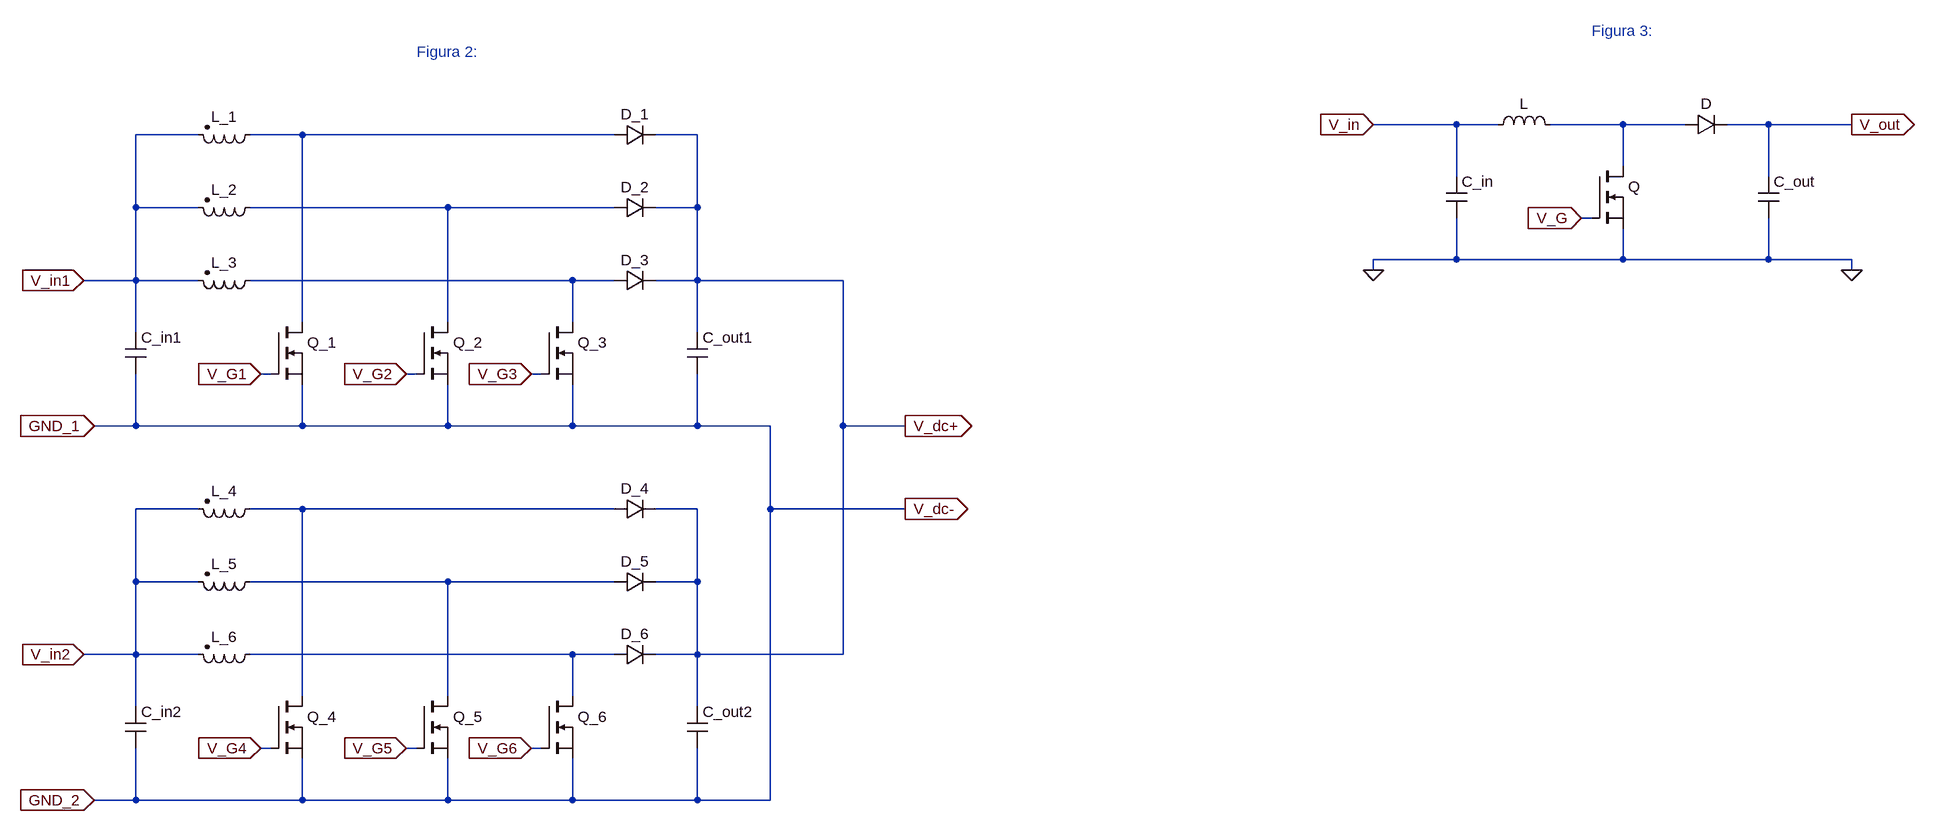
[diagram p0: schematic TFI - Esquemáticos.asc]
TFI - Esquemáticos.asc, the LTspice schematic file:
Version 4
SHEET 1 2784 1176
WIRE 2048 64 1920 64
WIRE 2112 64 2048 64
WIRE 2304 64 2192 64
WIRE 2400 64 2304 64
WIRE 2528 64 2464 64
WIRE 2656 64 2528 64
WIRE 112 80 16 80
WIRE 272 80 192 80
WIRE 752 80 272 80
WIRE 880 80 816 80
WIRE 2304 128 2304 64
WIRE 2048 144 2048 64
WIRE 2528 144 2528 64
WIRE 16 192 16 80
WIRE 112 192 16 192
WIRE 496 192 192 192
WIRE 752 192 496 192
WIRE 880 192 880 80
WIRE 880 192 816 192
WIRE 2256 208 2240 208
WIRE 2048 272 2048 208
WIRE 2048 272 1920 272
WIRE 2304 272 2304 224
WIRE 2304 272 2048 272
WIRE 2528 272 2528 208
WIRE 2528 272 2304 272
WIRE 2656 272 2528 272
WIRE 1920 288 1920 272
WIRE 2656 288 2656 272
WIRE 16 304 16 192
WIRE 16 304 -64 304
WIRE 112 304 16 304
WIRE 688 304 192 304
WIRE 752 304 688 304
WIRE 880 304 880 192
WIRE 880 304 816 304
WIRE 1104 304 880 304
WIRE 272 368 272 80
WIRE 496 368 496 192
WIRE 688 368 688 304
WIRE 16 384 16 304
WIRE 880 384 880 304
WIRE 224 448 208 448
WIRE 448 448 432 448
WIRE 640 448 624 448
WIRE 16 528 16 448
WIRE 16 528 -48 528
WIRE 272 528 272 464
WIRE 272 528 16 528
WIRE 496 528 496 464
WIRE 496 528 272 528
WIRE 688 528 688 464
WIRE 688 528 496 528
WIRE 880 528 880 448
WIRE 880 528 688 528
WIRE 992 528 880 528
WIRE 1104 528 1104 304
WIRE 1200 528 1104 528
WIRE 112 656 16 656
WIRE 272 656 192 656
WIRE 752 656 272 656
WIRE 880 656 816 656
WIRE 992 656 992 528
WIRE 1200 656 992 656
WIRE 16 768 16 656
WIRE 112 768 16 768
WIRE 496 768 192 768
WIRE 752 768 496 768
WIRE 880 768 880 656
WIRE 880 768 816 768
WIRE 16 880 16 768
WIRE 16 880 -64 880
WIRE 112 880 16 880
WIRE 688 880 192 880
WIRE 752 880 688 880
WIRE 880 880 880 768
WIRE 880 880 816 880
WIRE 1104 880 1104 528
WIRE 1104 880 880 880
WIRE 272 944 272 656
WIRE 496 944 496 768
WIRE 688 944 688 880
WIRE 16 960 16 880
WIRE 880 960 880 880
WIRE 224 1024 208 1024
WIRE 448 1024 432 1024
WIRE 640 1024 624 1024
WIRE 16 1104 16 1024
WIRE 16 1104 -48 1104
WIRE 272 1104 272 1040
WIRE 272 1104 16 1104
WIRE 496 1104 496 1040
WIRE 496 1104 272 1104
WIRE 688 1104 688 1040
WIRE 688 1104 496 1104
WIRE 880 1104 880 1024
WIRE 880 1104 688 1104
WIRE 992 1104 992 656
WIRE 992 1104 880 1104
FLAG -64 304 V_in1
IOPIN -64 304 In
FLAG -64 880 V_in2
IOPIN -64 880 In
FLAG 1200 528 V_dc+
IOPIN 1200 528 Out
FLAG 1200 656 V_dc-
IOPIN 1200 656 Out
FLAG 208 448 V_G1
IOPIN 208 448 In
FLAG 432 448 V_G2
IOPIN 432 448 In
FLAG 624 448 V_G3
IOPIN 624 448 In
FLAG 208 1024 V_G4
IOPIN 208 1024 In
FLAG 432 1024 V_G5
IOPIN 432 1024 In
FLAG 624 1024 V_G6
IOPIN 624 1024 In
FLAG -48 528 GND_1
IOPIN -48 528 In
FLAG -48 1104 GND_2
IOPIN -48 1104 In
FLAG 2656 288 0
FLAG 2656 64 V_out
IOPIN 2656 64 Out
FLAG 1920 288 0
FLAG 1920 64 V_in
IOPIN 1920 64 In
FLAG 2240 208 V_G
IOPIN 2240 208 In
SYMBOL nmos 224 368 R0
SYMATTR InstName Q_1
SYMATTR Value ""
SYMBOL nmos 448 368 R0
SYMATTR InstName Q_2
SYMATTR Value ""
SYMBOL nmos 640 368 R0
SYMATTR InstName Q_3
SYMATTR Value ""
SYMBOL cap 0 384 R0
SYMATTR InstName C_in1
SYMATTR Value ""
SYMBOL diode 752 96 R270
WINDOW 0 32 32 VTop 2
WINDOW 3 0 32 VBottom 2
SYMATTR InstName D_1
SYMATTR Value ""
SYMBOL diode 752 208 R270
WINDOW 0 32 32 VTop 2
WINDOW 3 0 32 VBottom 2
SYMATTR InstName D_2
SYMATTR Value ""
SYMBOL diode 752 320 R270
WINDOW 0 32 32 VTop 2
WINDOW 3 0 32 VBottom 2
SYMATTR InstName D_3
SYMATTR Value ""
SYMBOL cap 864 384 R0
SYMATTR InstName C_out1
SYMATTR Value ""
SYMBOL ind2 208 64 R90
WINDOW 0 4 56 VBottom 2
WINDOW 3 32 56 VTop 2
SYMATTR InstName L_1
SYMATTR Value ""
SYMBOL ind2 208 176 R90
WINDOW 0 4 56 VBottom 2
WINDOW 3 32 56 VTop 2
SYMATTR InstName L_2
SYMATTR Value ""
SYMBOL ind2 208 288 R90
WINDOW 0 4 56 VBottom 2
WINDOW 3 32 56 VTop 2
SYMATTR InstName L_3
SYMATTR Value ""
SYMBOL nmos 224 944 R0
SYMATTR InstName Q_4
SYMATTR Value ""
SYMBOL nmos 448 944 R0
SYMATTR InstName Q_5
SYMATTR Value ""
SYMBOL nmos 640 944 R0
SYMATTR InstName Q_6
SYMATTR Value ""
SYMBOL cap 0 960 R0
SYMATTR InstName C_in2
SYMATTR Value ""
SYMBOL diode 752 672 R270
WINDOW 0 32 32 VTop 2
WINDOW 3 0 32 VBottom 2
SYMATTR InstName D_4
SYMATTR Value ""
SYMBOL diode 752 784 R270
WINDOW 0 32 32 VTop 2
WINDOW 3 0 32 VBottom 2
SYMATTR InstName D_5
SYMATTR Value ""
SYMBOL diode 752 896 R270
WINDOW 0 32 32 VTop 2
WINDOW 3 0 32 VBottom 2
SYMATTR InstName D_6
SYMATTR Value ""
SYMBOL cap 864 960 R0
SYMATTR InstName C_out2
SYMATTR Value ""
SYMBOL ind2 208 640 R90
WINDOW 0 4 56 VBottom 2
WINDOW 3 32 56 VTop 2
SYMATTR InstName L_4
SYMATTR Value ""
SYMBOL ind2 208 752 R90
WINDOW 0 4 56 VBottom 2
WINDOW 3 32 56 VTop 2
SYMATTR InstName L_5
SYMATTR Value ""
SYMBOL ind2 208 864 R90
WINDOW 0 4 56 VBottom 2
WINDOW 3 32 56 VTop 2
SYMATTR InstName L_6
SYMATTR Value ""
SYMBOL cap 2032 144 R0
SYMATTR InstName C_in
SYMATTR Value ""
SYMBOL ind 2096 80 R270
WINDOW 0 32 56 VTop 2
WINDOW 3 5 56 VBottom 2
SYMATTR InstName L
SYMATTR Value ""
SYMBOL nmos 2256 128 R0
SYMATTR InstName Q
SYMATTR Value ""
SYMBOL diode 2400 80 R270
WINDOW 0 32 32 VTop 2
WINDOW 3 0 32 VBottom 2
SYMATTR InstName D
SYMATTR Value ""
SYMBOL cap 2512 144 R0
SYMATTR InstName C_out
SYMATTR Value ""
TEXT 448 -48 Left 2 ;Figura 2:
TEXT 2256 -80 Left 2 ;Figura 3:

The netlist it stands for:
* TFI - Esquemáticos.asc
M§Q_1 N002 V_G1 GND_2 GND_2
M§Q_2 N003 V_G2 GND_2 GND_2
M§Q_3 N004 V_G3 GND_2 GND_2
C_in1 V_in1 GND_2
D_1 N002 V_dc+
D_2 N003 V_dc+
D_3 N004 V_dc+
C_out1 V_dc+ GND_2
L_1 N002 V_in1
L_2 N003 V_in1
L_3 N004 V_in1
M§Q_4 N005 V_G4 GND_2 GND_2
M§Q_5 N006 V_G5 GND_2 GND_2
M§Q_6 N007 V_G6 GND_2 GND_2
C_in2 V_in2 GND_2
D_4 N005 V_dc+
D_5 N006 V_dc+
D_6 N007 V_dc+
C_out2 V_dc+ GND_2
L_4 N005 V_in2
L_5 N006 V_in2
L_6 N007 V_in2
C_in V_in 0
L V_in N001
M§Q N001 V_G 0 0
D N001 V_out
C_out V_out 0
.model D D
.lib standard.dio
.model NMOS NMOS
.model PMOS PMOS
.lib standard.mos
* Figura 2:
* Figura 3:
.backanno
.end